# EAGLE design ForPlants (EAGLE 7.2.0)
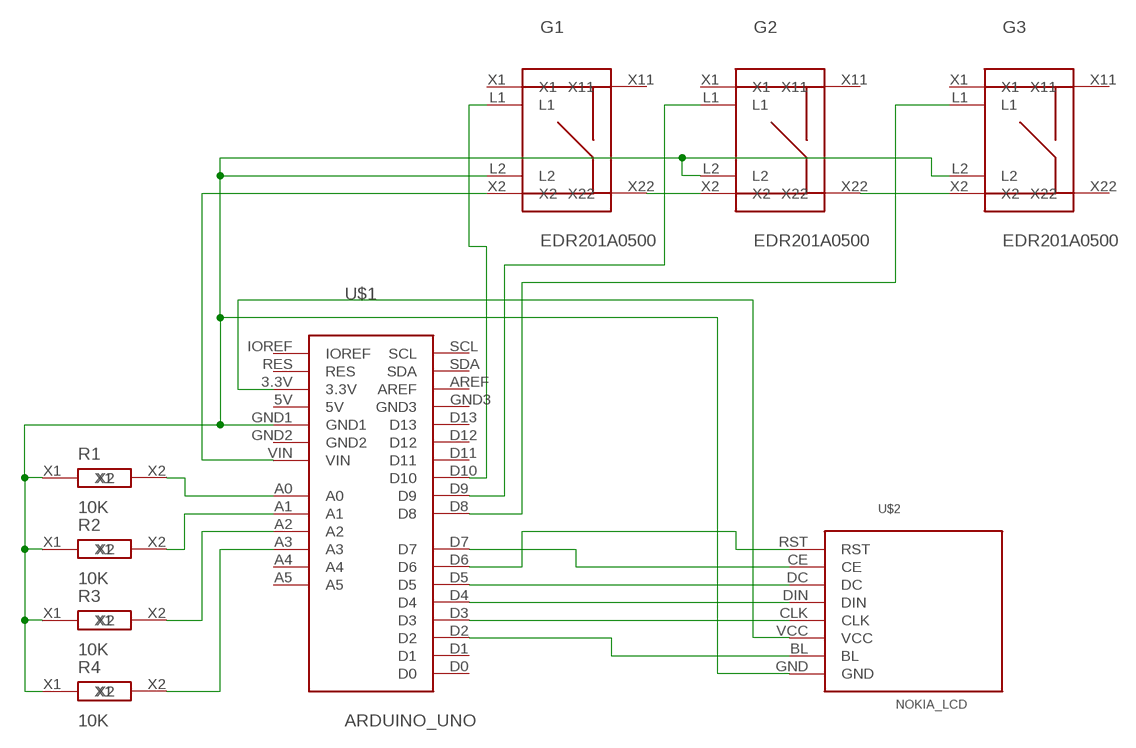
[diagram p0: schematic, sheet 1]

## Parts
G1  EDR201A0500  [EDR201A0500]
G2  EDR201A0500  [EDR201A0500]
G3  EDR201A0500  [EDR201A0500]
R1  10K  R_SMD_2.1X1.25  [SMD_2.1X1.25]
R2  10K  R_SMD_2.1X1.25  [SMD_2.1X1.25]
R3  10K  R_SMD_2.1X1.25  [SMD_2.1X1.25]
R4  10K  R_SMD_2.1X1.25  [SMD_2.1X1.25]
U$1  ARDUINO_UNO  [ARDUINO_UNO]
U$2  NOKIA_LCD  [NOKIA_LCD]

## Nets
N$1: U$1.D7 U$2.CE
N$2: U$1.D6 U$2.RST
N$3: U$1.D5 U$2.DC
N$4: U$1.D4 U$2.DIN
N$5: U$1.D3 U$2.CLK
N$6: U$1.D2 U$2.BL
N$8: U$1.3.3V U$2.VCC
N$9: R1.X2 U$1.A0
N$10: R2.X2 U$1.A1
N$11: R3.X2 U$1.A2
N$12: R4.X2 U$1.A3
N$13: G1.L2 G2.L2 G3.L2 R1.X1 R2.X1 R3.X1 R4.X1 U$1.GND1 U$2.GND
N$14: G1.X2 U$1.VIN
N$15: G1.X22 G2.X2
N$16: G2.X22 G3.X2
N$18: G1.L1 U$1.D10
N$19: G2.L1 U$1.D9
N$20: G3.L1 U$1.D8
Unconnected: G1.X1 G1.X11 G2.X1 G2.X11 G3.X1 G3.X11 G3.X22 U$1.5V U$1.A4 U$1.A5 U$1.AREF U$1.D0 U$1.D1 U$1.D11 U$1.D12 U$1.D13 U$1.GND2 U$1.GND3 U$1.IOREF U$1.RES U$1.SCL U$1.SDA

## Library data of the parts
G1-G3 = MyDuino:EDR201A0500
R1-R4 = MyPowerComponents:R_SMD_2.1X1.25
U$1 = MyDuino:ARDUINO_UNO
U$2 = MyDuino:NOKIA_LCD

## Board
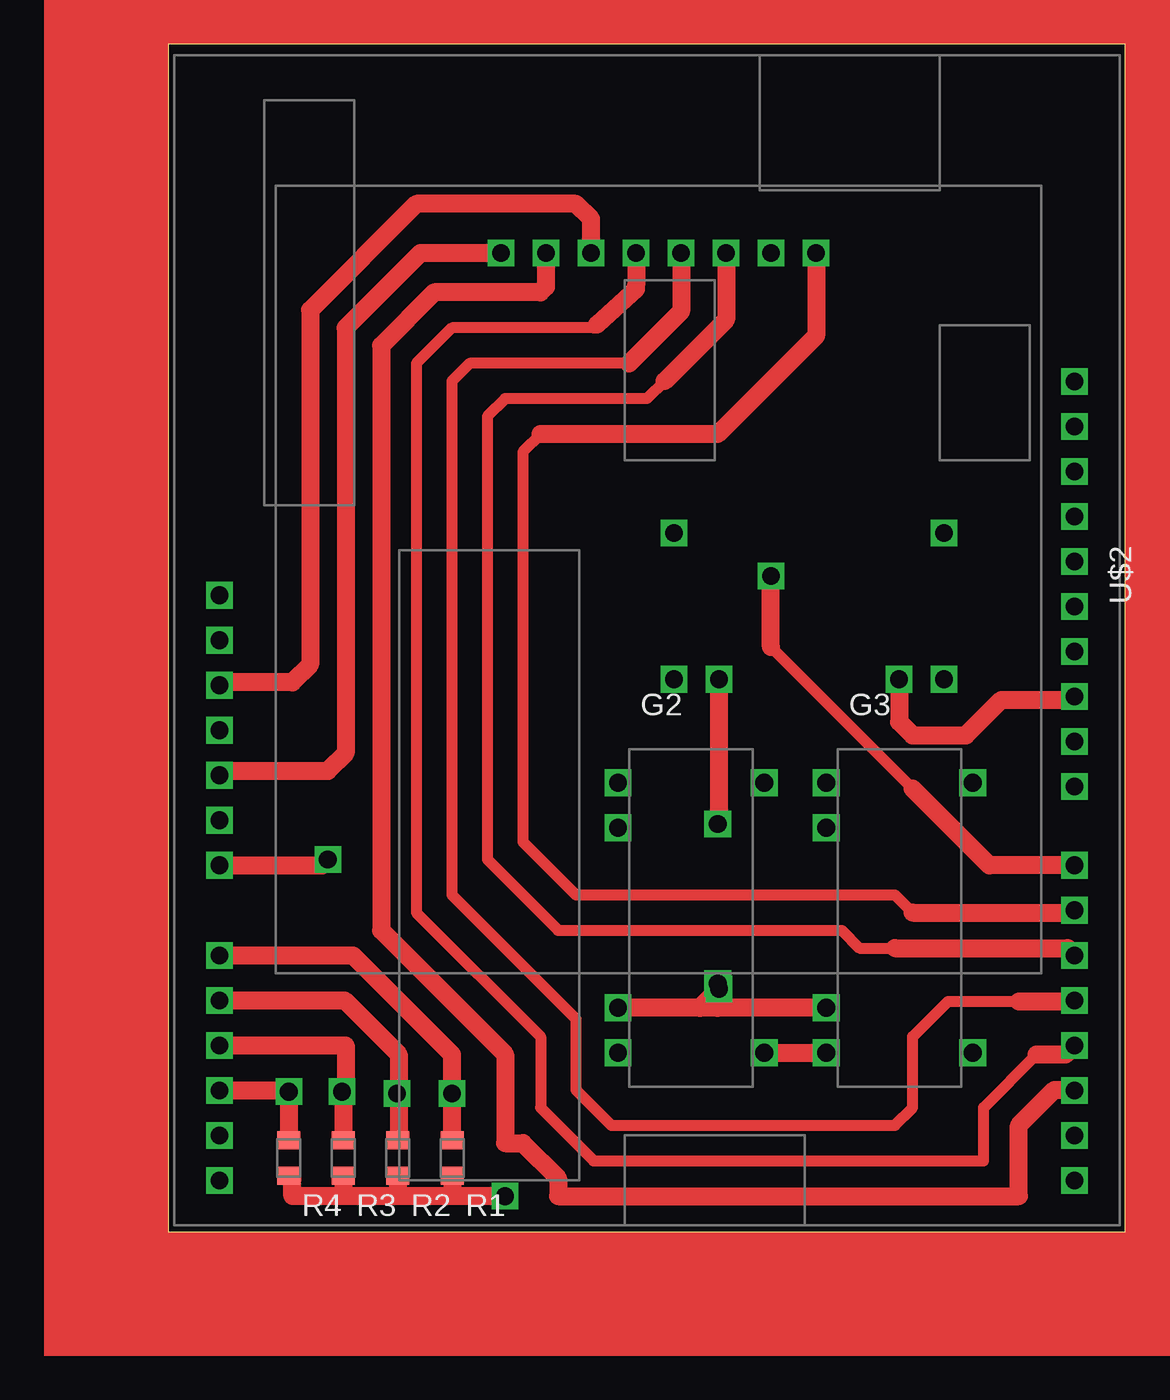
[diagram p1: board, top side]
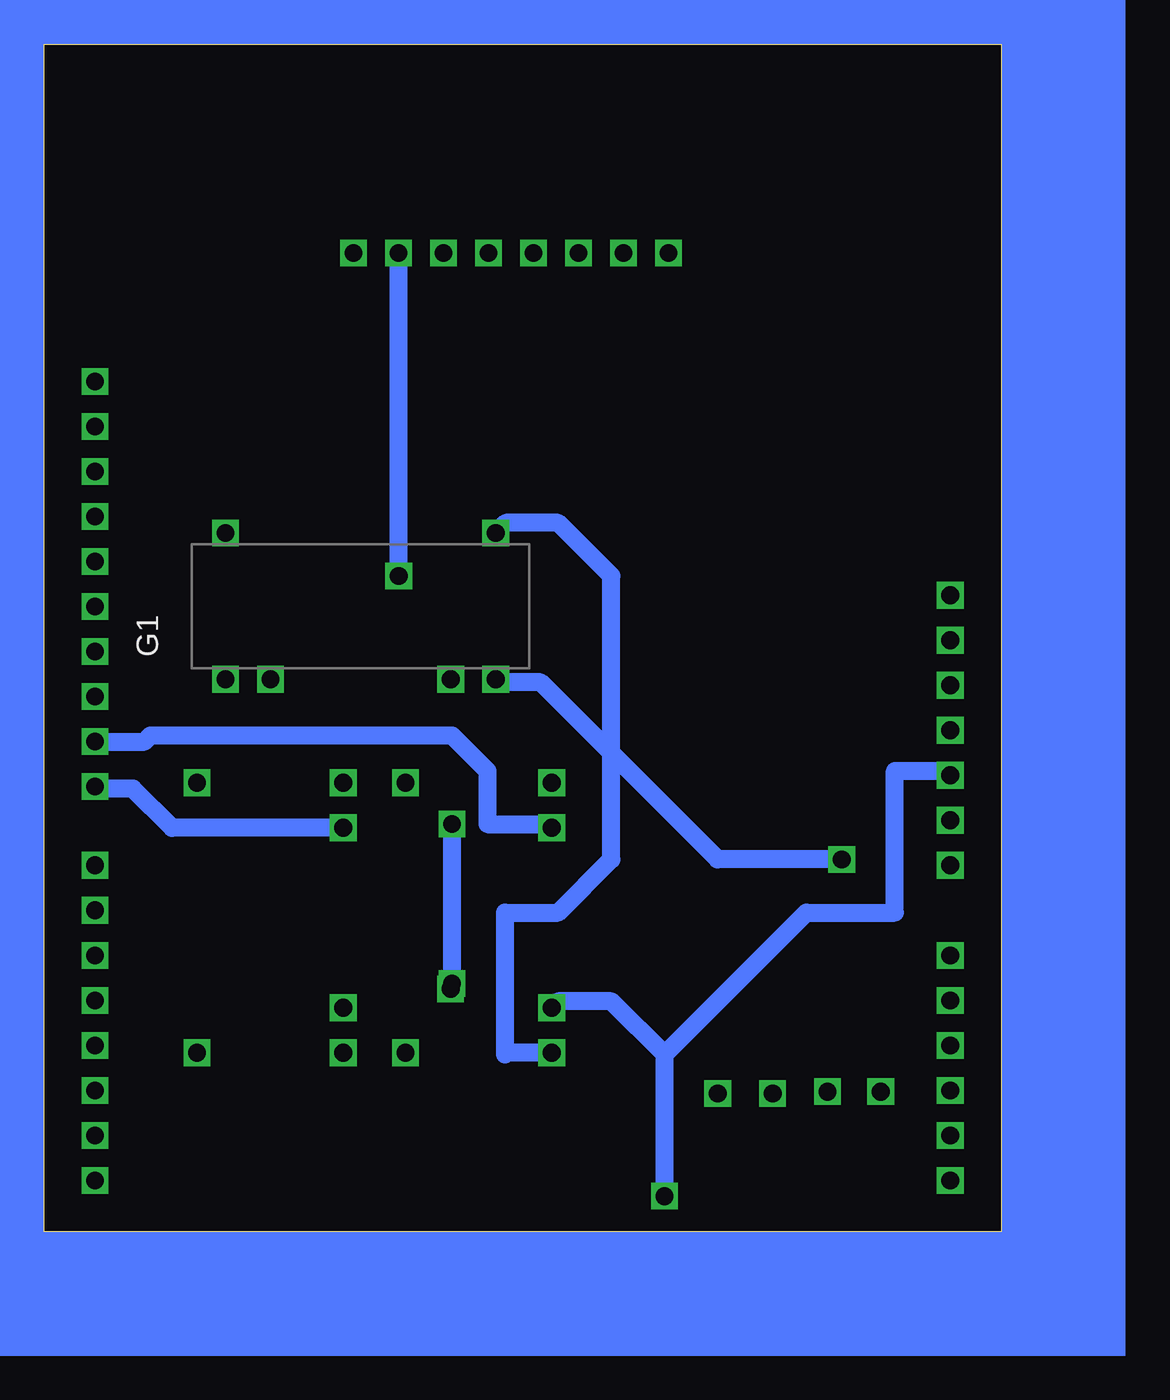
[diagram p2: board, bottom side, seen from below]

Size 54 x 67 mm. Coordinates in mm from the lower left corner, seen from the top.
Outline: 0,0 54,0 54,67 0,67 0,0
Copper layers (1*16): Top 0.035mm / dielectric 1.5mm / Bottom 0.035mm
Design rules "default": minimum track width 10mil, minimum drill 24mil, track to track 8mil, track to pad 8mil, pad to pad 8mil, via to via 8mil, smd to smd 8mil, copper to edge 40mil, drill to drill 8mil, minimum pad ring 10mil, minimum via ring 8mil, stop-mask expansion 4mil, vias tented up to drill 0mil, thermal gap 10mil

### Footprints (pad centres in the part's own frame; a part is rotated, then mirrored left to right if it is on the bottom)
EDR201A0500 = drill 1 square: L1 -2.54,5.08; L2 -2.54,-5.08; X1 -2.54,7.62; X2 -2.54,-7.62; X11 5.715,7.62; X22 5.715,-7.62
SMD_2.1X1.25 = smd 1.3 x 1: X1 0,1; X2 0,-1
ARDUINO_UNO = drill 1 square: 3.3V -10.16,5.08; 5V -10.16,2.54; A0 -10.16,-10.16; A1 -10.16,-12.7; A2 -10.16,-15.24; A3 -10.16,-17.78; A4 -10.16,-20.32; A5 -10.16,-22.86; AREF 38.1,17.145; D0 38.1,-22.86; D1 38.1,-20.32; D2 38.1,-17.78; D3 38.1,-15.24; D4 38.1,-12.7; D5 38.1,-10.16; D6 38.1,-7.62; D7 38.1,-5.08; D8 38.1,-0.635; D9 38.1,1.905; D10 38.1,4.445; D11 38.1,6.985; D12 38.1,9.525; D13 38.1,12.065; GND1 -10.16,0; GND2 -10.16,-2.54; GND3 38.1,14.605; IOREF -10.16,10.16; RES -10.16,7.62; SCL 38.1,22.225; SDA 38.1,19.685; VIN -10.16,-5.08
NOKIA_LCD = drill 1 square: BL -2.54,-7.62; CE -2.54,5.08; CLK -2.54,-2.54; DC -2.54,2.54; DIN -2.54,0; GND -2.54,-10.16; RST -2.54,7.62; VCC -2.54,-5.08

### Placement (x,y rotation side)
G1  36.15,33.71 90 bottom
G2  27.91,17.71 0 top
G3  39.67,17.71 0 top
R1  16.03,4.16 180 top
R2  12.95,4.16 180 top
R3  9.87,4.16 180 top
R4  6.79,4.16 180 top
U$1  13.04,25.75 0 top
U$2  28.93,52.68 270 top

### Tracks (layer width: path | path; a pad name or v marks a point on that pad's centre or on a via)
N$1  (via drill 1)
  Top 0.61: 42,25 34,33
  Top 1.016: U$1.D7 46.33,20.67 42,25 | U$2.CE | 34,33 v34,37
  Bottom 1.016: v34,37 U$2.CE
N$2
  Top 0.61: 21,45 20,44 20,22 23,19 41,19 42,18
  Top 1.016: U$2.RST 36.55,50.55 31,45 21,45 | 42,18 51.01,18 U$1.D6
N$3
  Top 0.61: 28,48 27,47 19,47 18,46 18,21 22,17 38,17 39,16 41,16
  Top 1.016: U$2.DC 31.47,51.47 28,48 | 41,16 50.73,16 U$1.D5
N$4
  Top 0.61: 26,49 17,49 16,48 16,19 23,12 23,8 25,6 41,6 42,7 42,11 44,13 48,13
  Top 1.016: U$2.DIN 28.93,51.93 26,49 | 48,13 51.09,13 U$1.D4
N$5
  Top 0.61: U$2.CLK 26.39,53.39 24.2,51.2 24,51 16,51 14,49 14,18 21,11 21,7 24,4 46,4 46,7 49,10
  Top 1.016: 49,10 50.63,10 U$1.D3 | 26.4,53.2 24.2,51.2
N$6
  Top 1.016: U$2.BL 21.31,53.31 21,53 15,53 12,50 12,17 19,10 19,5 20,5 22,3 22,2 48,2 48,6 50,8 51.11,8 U$1.D2
N$7  (via drill 1)
  other vias: 6.8,7.9
N$8
  Top 1.016: U$2.VCC 23.85,57.15 23,58 14,58 8,52 8,32 7,31 3.05,31 U$1.3.3V
N$9
  Top 1.016: U$1.A0 10.41,15.59 16,10 16,5.19 R1.X2
N$10
  Top 1.016: U$1.A1 9.95,13.05 13,10 13,5.21 R2.X2
N$11
  Top 1.016: U$1.A2 10,10.51 10,8 9.87,8 R3.X2
N$12
  Top 1.016: U$1.A3 7,7.97 7,8 6.79,8 R4.X2
N$13  (via drill 1)
  Top 1.016: U$2.GND 14.22,55.22 10,51 10,27 9,26 3.13,26 U$1.GND1 | v19,2 16,2 | 16,2 13,2 | 13,2 10,2 | 10,2 7,2 7,2.95 R4.X1 | R3.X1 9.87,2.13 10,2 | R2.X1 12.95,2.05 13,2 | R1.X1 16.03,2.03 16,2 | G3.L2 31,12.63 | 31,12.63 30,12.63 | 30,12.63 G2.L2 | 30,12.63 v31.07,13.7 31.07,12.7 31,12.63 | G1.L2 31.07,23.07 v31,23
  Bottom 1.016: v19,2 19,10 | G2.L2 25,13 22,13 19,10 | 19,10 11,18 6,18 6,26 3.13,26 U$1.GND1 | v31,23 31,13.77 v31.07,13.7
N$14  (via drill 1)
  Top 1.016: 28.36,31 G1.X2 | U$1.VIN 8.67,20.67 v9,21
  Bottom 1.016: v9,21 16,21 26,31 28.36,31 G1.X2
N$15
  Bottom 1.016: G2.X2 27.91,10.09 28,10 28,18 25,18 22,21 22,37 25,40 27.95,40 G1.X22
N$16
  Top 1.016: G2.X22 G3.X2
N$17  (via drill 1)
  other vias: 9.8,7.9
N$18
  Top 1.016: G1.L1 41.23,28.77 42,28 45,28 47,30 50.95,30 U$1.D10
N$19
  Bottom 1.016: U$1.D9 48.34,27.66 48,28 31,28 29,26 29,23 25.58,23 G2.L1
N$20
  Top 1.016: 51.02,25 U$1.D8
  Bottom 1.016: G3.L1 46.79,22.79 49,25 51.02,25 U$1.D8
N$21  (via drill 1)
  other vias: 12.9,7.8
N$22  (via drill 1)
  other vias: 16,7.8
N$23  (via drill 1)
  other vias: 9,21
N$24  (via drill 1)
  other vias: 31,23
N$25  (via drill 1)
  other vias: 31,14
N$26  (via drill 1)
  other vias: 34,37
N$27
  Top 1.016: 26.4,55.2 26.4,53.4
(copper drawn outside any net)
  shapes: Bottom area x5, Top area x5